# Altium schematic sheet CANbus.SchDoc
size OrCAD C; SheetNumber: 6; SheetTotal: 7
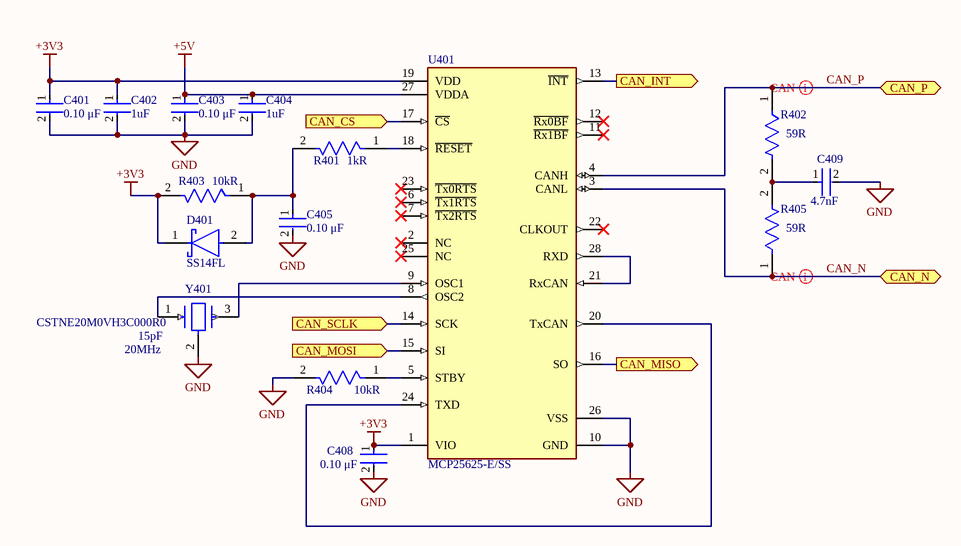
[diagram p0: CANbus.SchDoc]

## Parts
C401  Capacitance: 0.10 μF  [FP-C0603C-CF-MFG]  (hidden comment: C0603C104K5RACAUTO)
C402  Capacitance: 1uF  [FP-C0603C-CJ-MFG]  (hidden comment: C0603C105K4RACAUTO)
C403  Capacitance: 0.10 μF  [FP-C0603C-CF-MFG]  (hidden comment: C0603C104K5RACAUTO)
C404  Capacitance: 1uF  [FP-C0603C-CJ-MFG]  (hidden comment: C0603C105K4RACAUTO)
C405  Capacitance: 0.10 μF  [FP-C0603C-CF-MFG]  (hidden comment: C0603C104K5RACAUTO)
C408  Capacitance: 0.10 μF  [FP-C0603C-CF-MFG]  (hidden comment: C0603C104K5RACAUTO)
C409  Capacitance: 4.7nF  [FP-GRM155-0_05-MFG]  (hidden comment: GRM155R72A472KA01D)
D401  SS14FL  [FP-425AD-MFG]
R401  Resistance: 1kR  [FP-RMCF0603-IPC_C]  (hidden comment: RMCF0603JT1K00)
R402  Resistance: 59R  [FP-CRCW0603-HPe3-IPC_A]  (hidden comment: CRCW060359R0FKEAHP)
R403  Resistance: 10kR  [FP-RMCF0603-IPC_C]  (hidden comment: RMCF0603JT10K0)
R404  Resistance: 10kR  [FP-RMCF0603-IPC_C]  (hidden comment: RMCF0603JT10K0)
R405  Resistance: 59R  [FP-CRCW0603-HPe3-IPC_A]  (hidden comment: CRCW060359R0FKEAHP)
U401  MCP25625-E/SS  [FP-C04-073-MFG]
Y401  CSTNE20M0VH3C000R0  Frequency: 20MHz  Capacitance: 15pF  [FP-CSTNE20M0VH3C000R0-MFG]

## Ports
CAN_CS (in), CAN_INT (out), CAN_MISO (out), CAN_MOSI (in), CAN_N (bidir), CAN_P (bidir), CAN_SCLK (in)

## Nets
+3V3: C401.1 C402.1 C408.1 D401.1(C) R403.2 U401.1(VIO) U401.19(VDD)
+5V: C403.1 C404.1 U401.27(VDDA)
GND: C401.2 C402.2 C403.2 C404.2 C405.2 C408.2 C409.2 R404.2 U401.10(GND) U401.26(VSS) Y401.2(GND)
CAN_CS: U401.17(~{CS}) ; port CAN_CS
CAN_INT: U401.13(~{INT}) ; port CAN_INT
CAN_MISO: U401.16(SO) ; port CAN_MISO
CAN_MOSI: U401.15(SI) ; port CAN_MOSI
CAN_N: R405.1 U401.3(CANL) ; port CAN_N
CAN_P: R402.1 U401.4(CANH) ; port CAN_P
CAN_SCLK: U401.14(SCK) ; port CAN_SCLK
NetC405_1: C405.1 D401.2(A) R401.2 R403.1
NetC409_1: C409.1 R402.2 R405.2
NetR401_1: R401.1 U401.18(~{RESET})
NetR404_1: R404.1 U401.5(STBY)
NetU401_8: U401.8(OSC2) Y401.1(Input)
NetU401_9: U401.9(OSC1) Y401.3(Output)
NetU401_20: U401.20(TxCAN) U401.24(TXD)
NetU401_21: U401.21(RxCAN) U401.28(RXD)

Not connected (* = marked no-connect by the designer): U401 2(NC)* 6(~{Tx1RTS})* 7(~{Tx2RTS})* 11(~{Rx1BF})* 12(~{Rx0BF})* 22(CLKOUT)* 23(~{Tx0RTS})* 25(NC)*

## Layout directives
differential pair: CAN_N, CAN_P

## Library data of the parts
C401 C403 C405 C408 = CMP-2006-03060-2: CAP CER 0.1UF 50V X7R 0603; Manufacturer: KEMET; Tolerance: 0.1; Material: Ceramic; Value: 0.10 μF; Automotive Grade: Grade 1; Temperature Coefficient: 30ppm/°C; RoHS: TRUE; Temperature Range Low: -55°C; Automotive: Yes; Octopart: https://octopart.com/c0603c104k5racauto-kemet-12563741; Temperature Characteristic: X7R; Category: Cap; Voltage Rating: 50 V; Mouser Description: Multilayer Ceramic Capacitors MLCC - SMD/SMT 0.1uF 50volts 10% X7R AUTO; ComponentLink2Description: Datasheet; Device Class L2: Capacitors; Digikey Description: CAP CER 0.1UF 50V X7R 0603; Manufacturer Part Number: C0603C104K5RACAUTO; ComponentLink2URL: https://api.kemet.com/component-edge/download/datasheet/C0603C100J5GACAUTO.pdf; Lead Free: Yes; Height: 0.87mm; Device Class L3: Ceramic Capacitors; Device Class L1: Passive Components; Temperature Range High: +125°C; Package: C0603C-CF; Temperature: -55°C to +125°C
C402 C404 = CMP-03020-014193-1: CAP CER 0603 1UF 16V X7R 10%; Manufacturer: KEMET; Temperature Coefficient: 15%; Automotive Grade: Grade 1; Material: Ceramic; Digikey Description: CAP CER 0603 1UF 16V X7R 10%; Octopart: https://octopart.com/c0603c105k4racauto-kemet-91328491; Package: C0603C-CJ; ComponentLink2Description: Datasheet; Mouser Description: Cap Ceramic 1uF 16V X7R 10% Pad SMD 0603 125C Automotive T/R; Automotive: Yes; Tolerance: 10%; Manufacturer Part Number: C0603C105K4RACAUTO; Lead Free: Yes; Temperature: -55°C to +125°C; ComponentLink2URL: https://content.kemet.com/datasheets/KEM_C1023_X7R_AUTO_SMD.pdf; Temperature Range Low: -55°C; Ipc Land Pattern Name: CAPC16080X80; Device Class L1: Passive Components; Temperature Characteristic: X7R; Device Class L2: Capacitors; Height: 0.95mm; Device Class L3: Ceramic Capacitors; RoHS: TRUE; Category: Cap; Temperature Range High: +125°C; Value: 1uF; Voltage Rating: 16V
C409 = CMP-2008-03941-2: Chip Multilayer Ceramic Capacitors for General Purpose, 0402, 4700pF, X7R, 15%, 10%, 100V; Depth: 0.5mm; Case/Package: 0402; Radiation Hardening: No; Height: 0.5mm; Length: 1mm; Dielectric: X7R; Thickness: 0.022inch; Voltage: 100V; Case Code (Metric): 1005; Mount: Surface Mount; Packaging: Tape and Reel; Voltage Rating (DC): 100V; Termination: SMD/SMT; Width: 0.5mm; Tolerance: 10%; Min Operating Temperature: -55°C; Case Code (Imperial): 0402; Voltage Rating: 100V; Max Operating Temperature: 125°C; Lead Free: Lead Free; Package Quantity: 1
D401 = CMP-07162-000013-1: DIODE SCHOTTKY 40V 1A SOD123F; Manufacturer: ON Semiconductor; Max Junction Temp: +125°C; Value: 60pF; Max Surge Forward Current: 40A; Peak Reverse Current: 30uA; Device Class L3: Schottky Diodes; Reverse Voltage: 40V; Automotive: No; Temperature: -55°C to +125°C; Mouser Description: SS14FL Series 40 V 1 A Surface Mount Schottky Barrier Rectifier - SOD-123F; Octopart: https://octopart.com/ss14fl-on+semiconductor-84331601; Height: 1.08mm; Temperature Range Low: -55°C; Category: Diode; Lead Free: Yes; Device Class L1: Discrete Semiconductors; Digikey Description: DIODE SCHOTTKY 40V 1A SOD123F; RoHS: TRUE; ComponentLink2Description: Datasheet; Manufacturer Part Number: SS14FL; Forward Current: 1A; Capacitance: 60pF; Package: 425AD; Device Class L2: Diodes; Temperature Range High: +125°C; Max Repetitive Reverse Voltage: 40V; ComponentLink2URL: https://www.onsemi.com/pub/Collateral/SS14FL-D.PDF
R401 = CMP-26527-001474-1: 1kΩ ±5% 0.1W 0603 Thick Film Chip Resistor AEC-Q200 compliant; Temperature Coefficient: 100ppm/°C; Power Rating: 100mW; Working Voltage: 75V; Width: 0.031inch; Resistor Type: Thick Film; Technology: THICK FILM; Construction: Rectangular; Case Code (Metric): 1608; Min Operating Temperature: -55°C; Length: 1.55mm; Military Standard: Not; Radiation Hardening: No; Contact Plating: Tin; Lead Free: Lead Free; Case Code (Imperial): 0603; Mount: Surface Mount; Case/Package: 0603; RoHS Compliant: Yes; Max Operating Temperature: 155°C; Series: RMCF; Tolerance: 5%; Number of Terminations: 2; Features: Automotive AEC-Q200; Packaging: Tape and Reel; Depth: 0.8mm; Max Power Dissipation: 100mW; Height: 0.022inch
R402 R405 = CMP-02407-004126-1: RES Thick Film, 59Ω, 1%, 0.33W, 100ppm/°C, 0603; Voltage Rating: 75V; Power Rating: 250mW; Case Code (Metric): 1608; Packaging: Tape and Reel; Features: Automotive AEC-Q200; Min Operating Temperature: -55°C; Case Code (Imperial): 0603; Length: 1.6mm; Width: 0.033inch; Radiation Hardening: No; Number of Terminations: 2; Depth: 0.85mm; Termination: SMD/SMT; Case/Package: 0603; Height: 0.45mm; Tolerance: 1%; Weight: 7.1E-05oz; Temperature Coefficient: 100ppm/°C; Contact Plating: Tin; Max Operating Temperature: 155°C; Composition: Thick Film; Max Power Dissipation: 250mW; Lead Free: Lead Free; Package Quantity: 10
R403 R404 = CMP-26527-002098-1: 10kΩ ±5% 0.1W 0603 Thick Film Chip Resistor AEC-Q200 compliant; Power Rating: 100mW; Temperature Coefficient: 100ppm/°C; Radiation Hardening: No; Military Standard: Not; Mount: Surface Mount; Resistor Type: Thick Film; Size Code: 0603; Case/Package: 0603; Min Operating Temperature: -55°C; Construction: Rectangular; Series: RMCF; Width: 0.031inch; Length: 1.55mm; Case Code (Metric): 1608; Depth: 0.8mm; Height: 0.022inch; Packaging: Tape and Reel; Lead Free: Lead Free; Tolerance: 5%; Case Code (Imperial): 0603; Max Operating Temperature: 155°C; Contact Plating: Tin; Max Power Dissipation: 100mW; Features: Automotive AEC-Q200; Number of Terminations: 2
U401 = CMP-06279-000004-1: IC TXRX CAN CTLR EXT TEMP 28SSOP; Manufacturer: Microchip; Min Supply Voltage: 2.7V; Interface: SPI,CAN; Max Supply Voltage: 5.5V; Automotive Grade: Grade 1; Nominal Supply Current: 10mA; Standoff Height: 0.05mm; Max Junction Temp: +150°C; Octopart: https://octopart.com/mcp25625-e%2Fss-microchip-38886007; Digikey Description: IC TXRX CAN CTLR EXT TEMP 28SSOP; Automotive: Yes; Lead Free: Yes; Package: C04-073; Device Class L3: unset; Device Class L1: Integrated Circuits (ICs); Ambient Temperature Range Low: -40°C; Device Class L2: Interface ICs; ComponentLink2URL: http://ww1.microchip.com/downloads/en/DeviceDoc/MCP25625-CAN-Controller-Data-Sheet-20005282C.pdf; Ambient Temperature Range High: +125°C; Height: 2mm; Mouser Description: CAN Interface IC CAN Controller with Int. Transceiver; RoHS: TRUE; Temperature: -40°C to +125°C; Ipc Land Pattern Name: SOP65P780X200-28; Manufacturer Part Number: MCP25625-E/SS; ComponentLink2Description: Datasheet; Temperature Range High: +125°C; Temperature Range Low: -40°C; Category: IC
Y401 = CMP-06057-000018-1: CERAMIC RES 20.0000MHZ 15PF SMD; Frequency Stability: 0.13%; Frequency Tolerance: 0.07%; Impedance: 40R; RoHS Compliant: Yes; Packaging: Cut Tape; Mount: Surface Mount; Case/Package: SMD/SMT; Max Operating Temperature: 125°C; Min Operating Temperature: -40°C; Resistor Type: Ceramic